# EAGLE board Amplifier+Mixer (EAGLE 9.3.0)
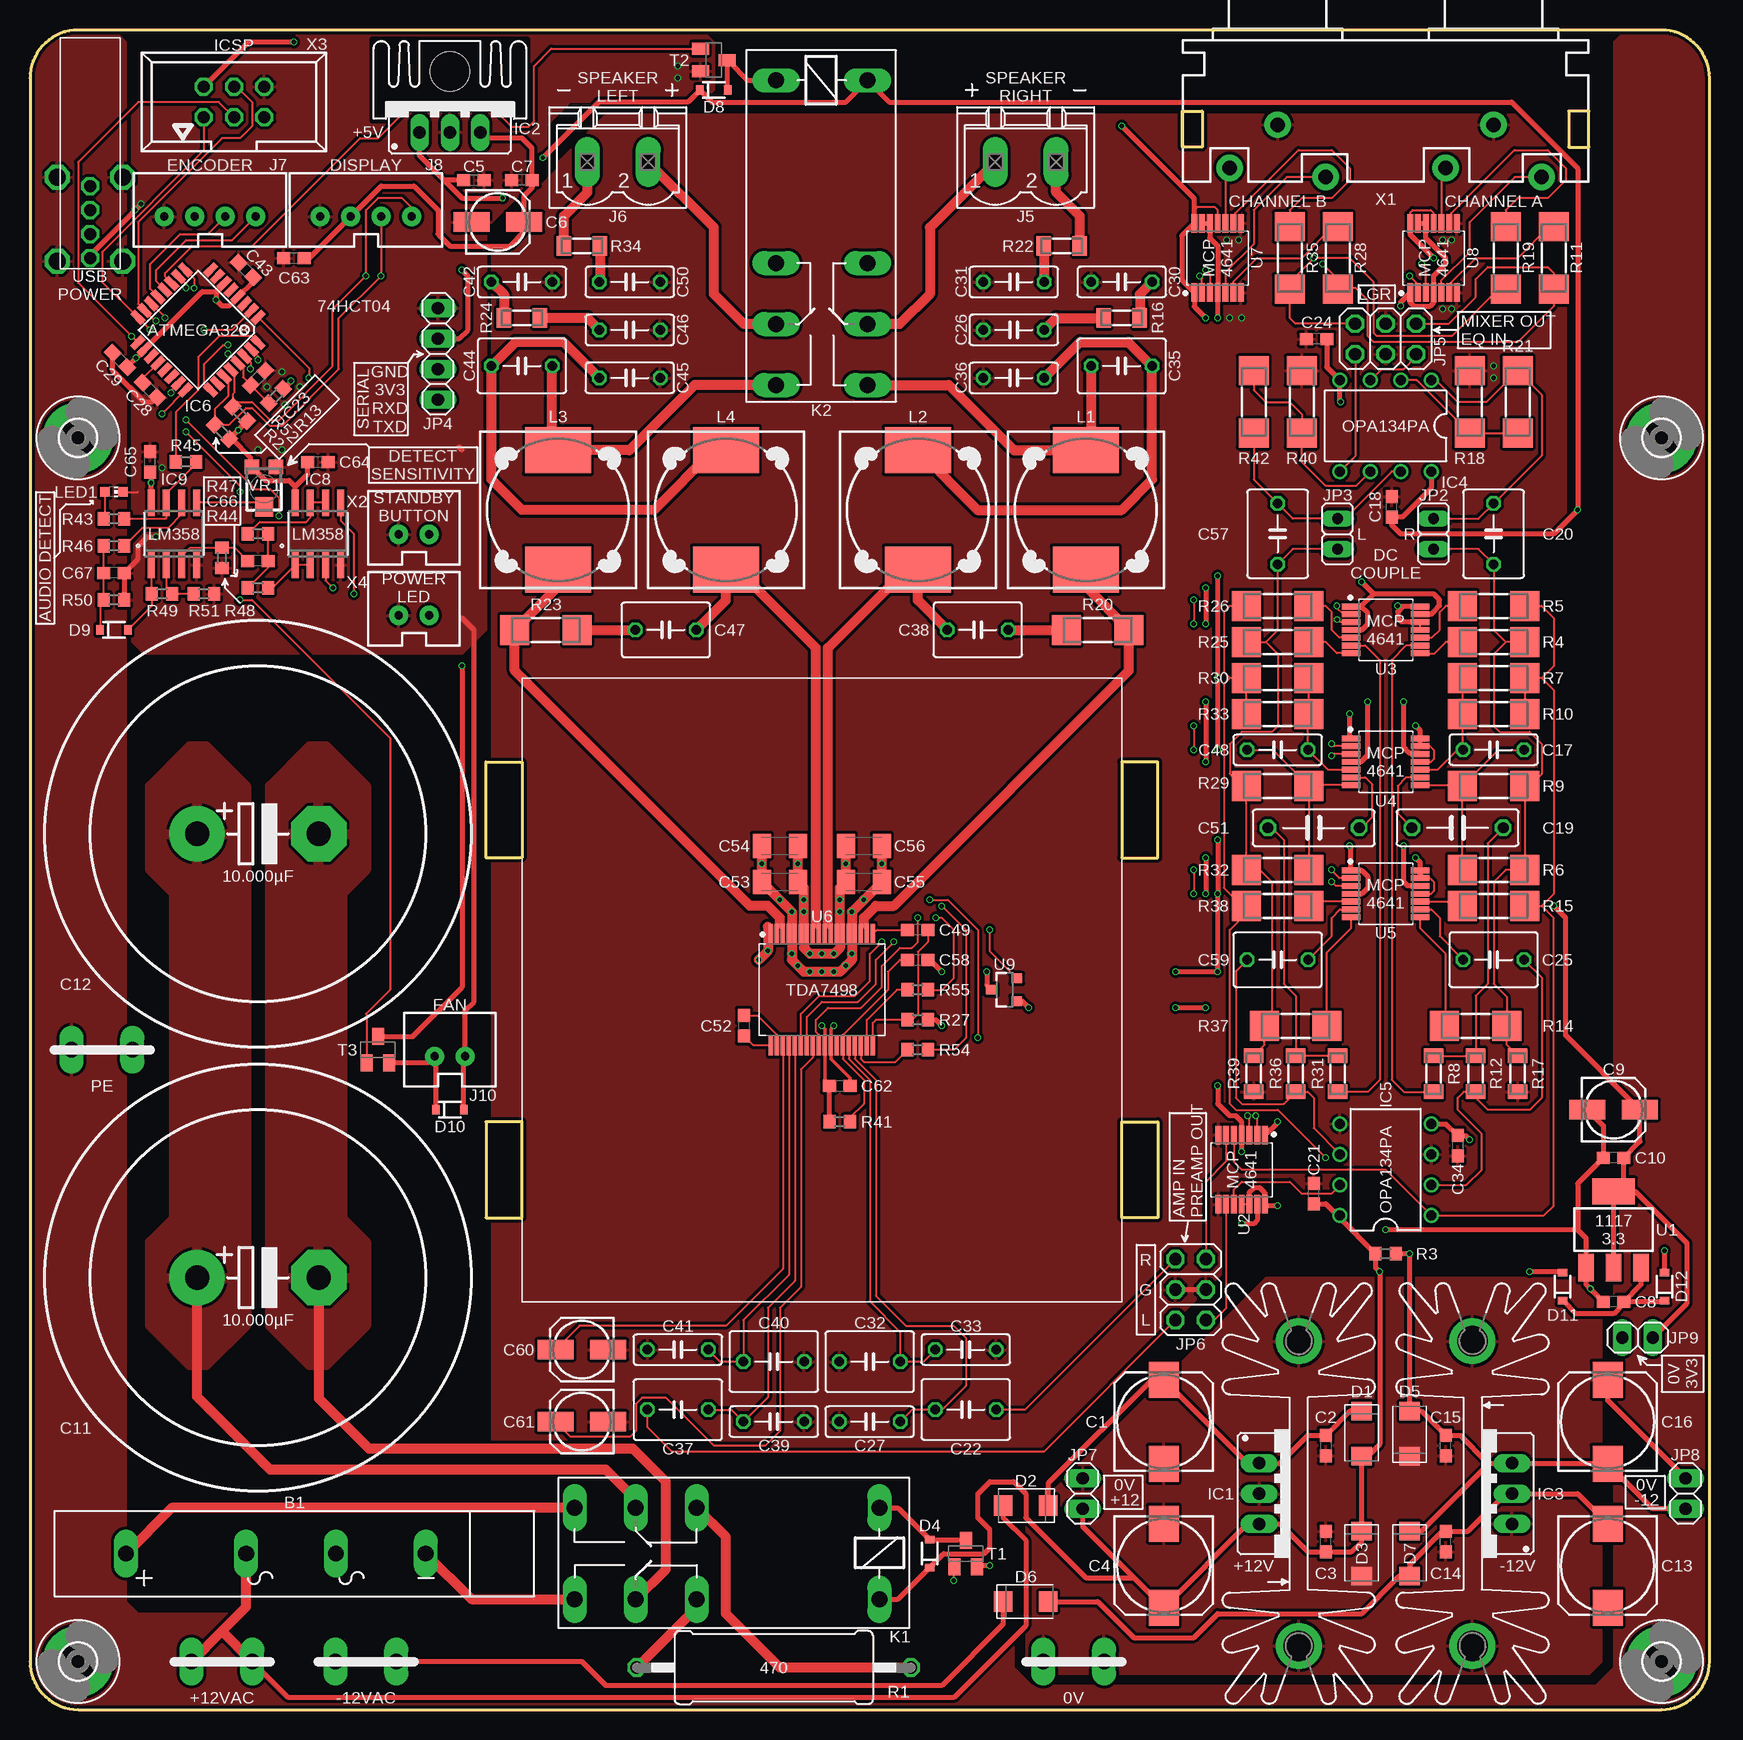
[diagram p2: board, top side]
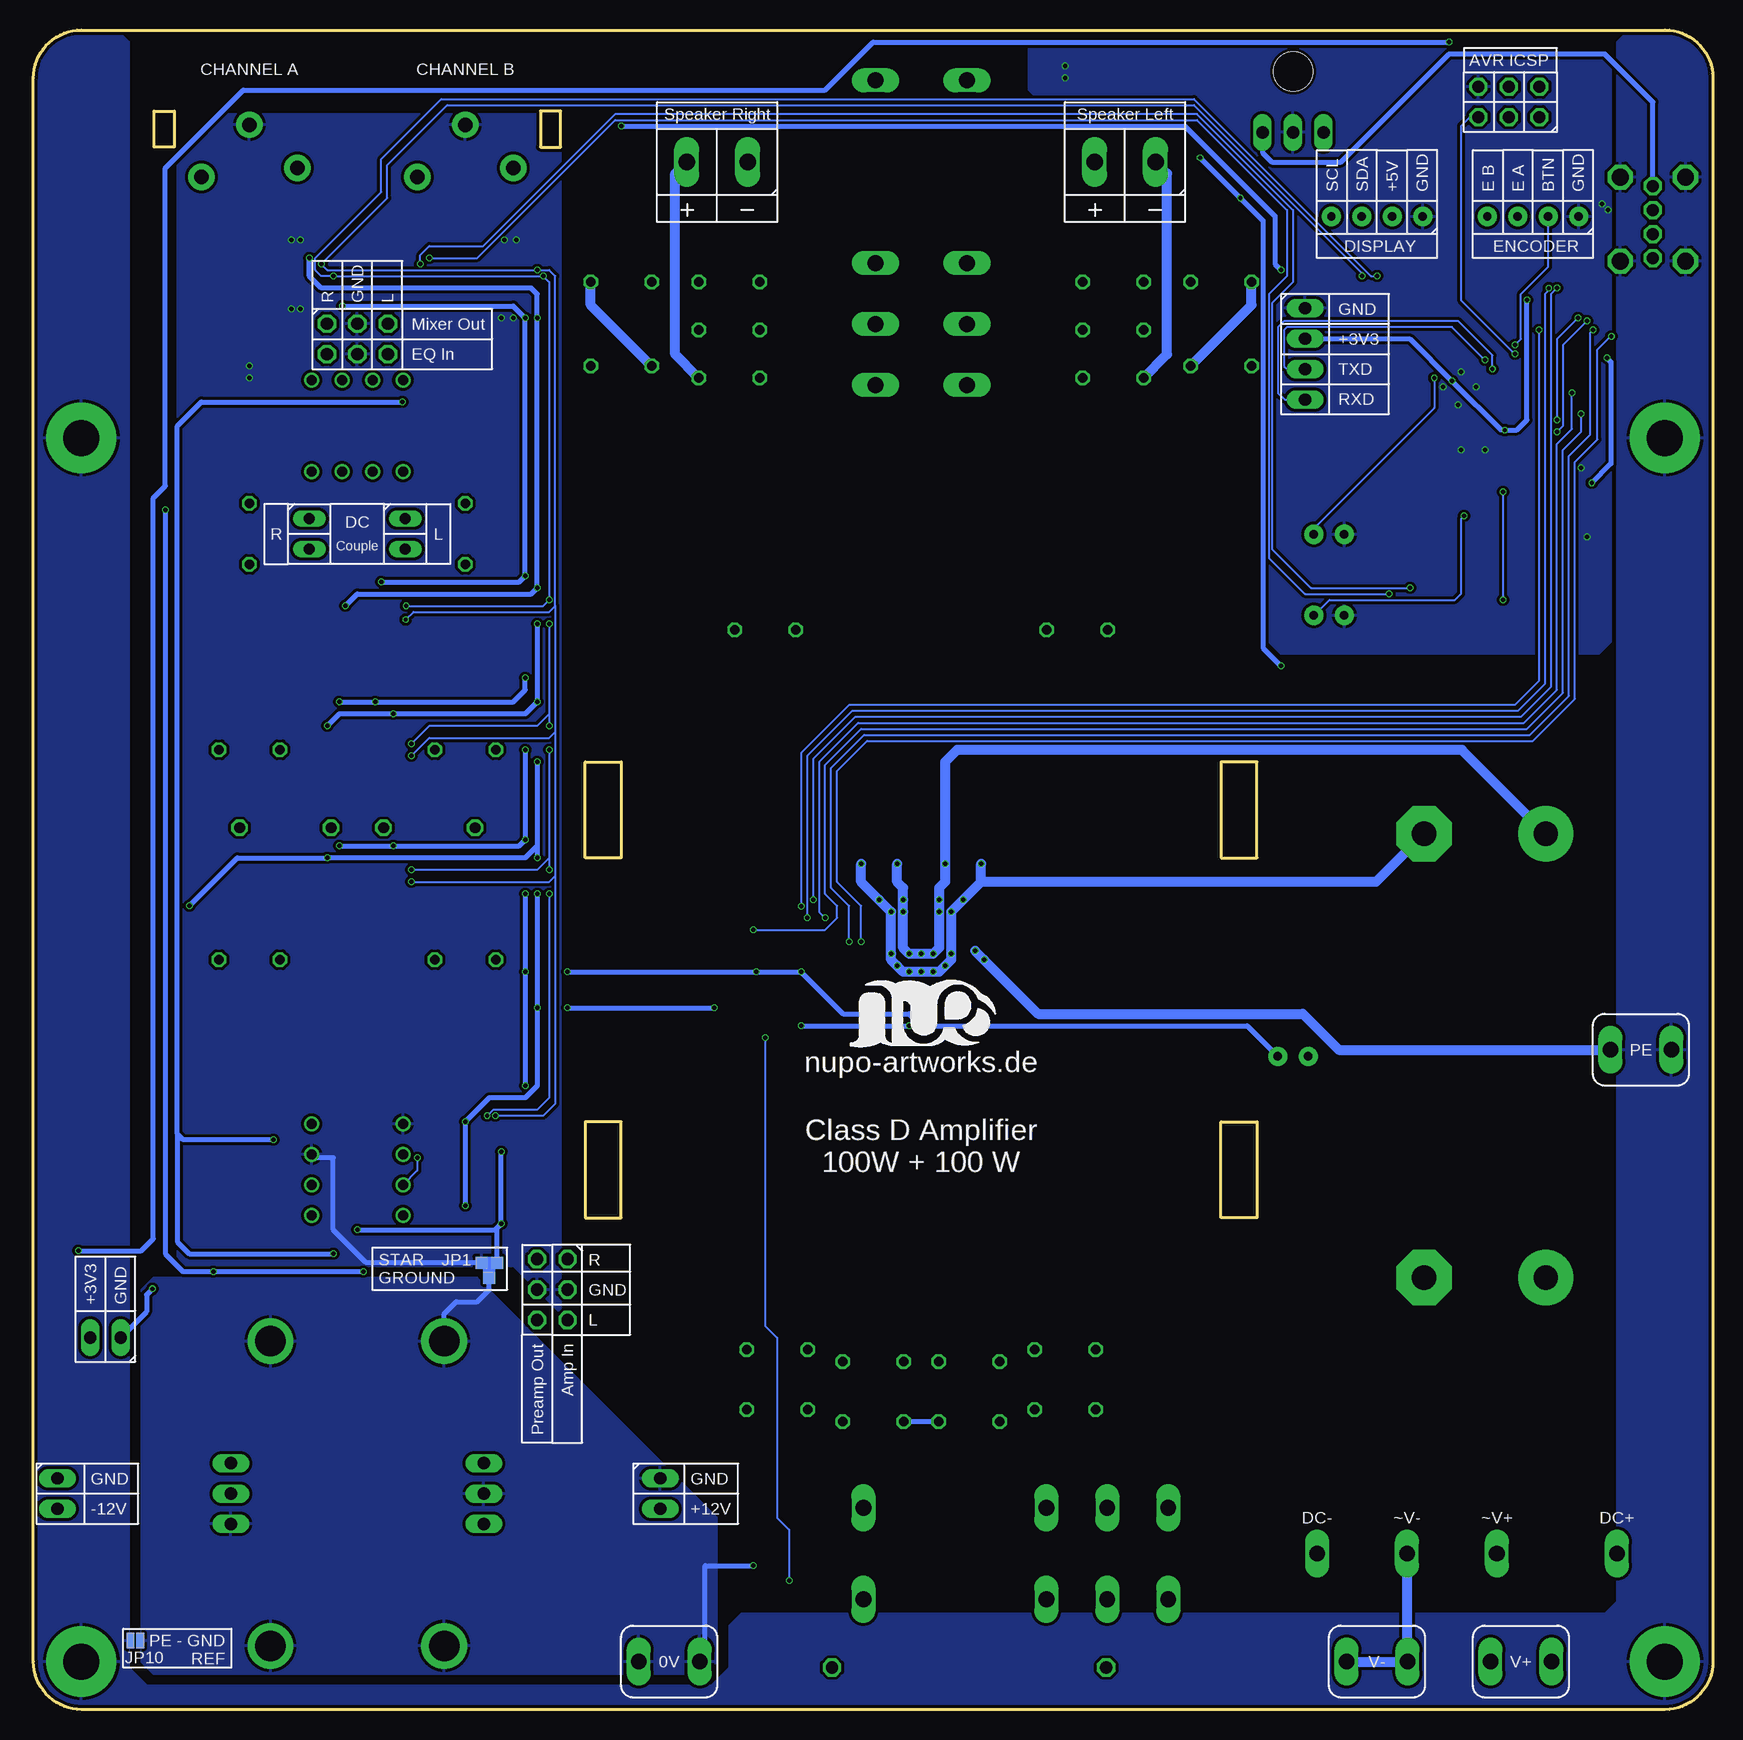
[diagram p3: board, bottom side, seen from below]

Size 140 x 140 mm. Coordinates in mm from the lower left corner, seen from the top.
Outline: 4,0 136,0 arc90 140,4 140,136 arc90 136,140 4,140 arc90 0,136 0,4 arc90 4,0
Outline: 129.95,133.25 128.25,133.25 128.25,130.25 129.95,130.25 129.95,133.25
Outline: 96.05,130.25 96.05,133.25 97.72,133.25 97.72,130.25 96.05,130.25
Outline: 41,49 38,49 38,41 41,41 41,49
Outline: 91,41 91,49 94,49 94,41 91,41
Outline: 91,79 91,71 94,71 94,79 91,79
Outline: 41,79 41,71 38,71 38,79 41,79
Copper layers (1*16): Top 0.035mm / dielectric 1.5mm / Bottom 0.035mm
Design rules "JLCPCB-Tented *": minimum track width 3.5mil, minimum drill 0.2mm, track to track 3.5mil, track to pad 5mil, pad to pad 6mil, via to via 6mil, smd to smd 3.5mil, copper to edge 0.2mm, drill to drill 5mil, minimum pad ring 3mil, minimum via ring 3mil, stop-mask expansion 4mil, vias tented up to drill 0.5mm, thermal gap 10mil

## Footprints (pad centres in the part's own frame; a part is rotated, then mirrored left to right if it is on the bottom)
FB100 = drill 1.321 long: + -14,0; - 10.994,0; AC1 -3.992,0; AC2 3.501,0
175TMP-0810 = smd 3 x 2.5: + 3.5,0; - -3.5,0
C0603 = smd 1.1 x 1: 1 -0.85,0; 2 0.85,0
153CLV-0505 = smd 3 x 1.6: + 2.2,0; - -2.2,0
EB35D = drill 2.007 pad 4.597: + -5.08,0 | drill 2.007 pad 4.597 octagon: - 5.08,0
C050-025X075 = drill 0.813 octagon: 1 -2.54,0; 2 2.54,0
C075-032X103 = drill 0.914 octagon: 1 -3.81,0; 2 3.81,0
C050-050X075 = drill 0.813 octagon: 1 -2.54,0; 2 2.54,0
C050-045X075 = drill 0.813 octagon: 1 -2.54,0; 2 2.54,0
C1206K = smd 1.5 x 2: 1 -1.5,0; 2 1.5,0
SODFL5024X231 = smd 1.52 x 1.68: A 1.88,0; C -1.88,0
SOD-323 = smd 0.63 x 0.83: A 1.15,0; C -1.15,0
3,0-PAD = drill 3 pad 5.842: B3,0 0,0
78XXS = drill 1.016 long: GND 0,-2.54; IN -2.54,-2.54; OUT 2.54,-2.54
79XXS = drill 1.016 long: GND -2.54,-2.54; IN 0,-2.54; OUT 2.54,-2.54
DIL08 = drill 0.813 pad 1.27: 1 -3.81,-3.81; 2 -1.27,-3.81; 3 1.27,-3.81; 4 3.81,-3.81; 5 3.81,3.81; 6 1.27,3.81; 7 -1.27,3.81; 8 -3.81,3.81
TQFP32-08 = smd 1.27 x 0.559: 1 -4.293,2.8; 2 -4.293,2; 3 -4.293,1.2; 4 -4.293,0.4; 5 -4.293,-0.4; 6 -4.293,-1.2; 7 -4.293,-2; 8 -4.293,-2.8; 17 4.293,-2.8; 18 4.293,-2; 19 4.293,-1.2; 20 4.293,-0.4; 21 4.293,0.4; 22 4.293,1.2; 23 4.293,2; 24 4.293,2.8 | smd 0.559 x 1.27: 9 -2.8,-4.293; 10 -2,-4.293; 11 -1.2,-4.293; 12 -0.4,-4.293; 13 0.4,-4.293; 14 1.2,-4.293; 15 2,-4.293; 16 2.8,-4.293; 25 2.8,4.293; 26 2,4.293; 27 1.2,4.293; 28 0.4,4.293; 29 -0.4,4.293; 30 -1.2,4.293; 31 -2,4.293; 32 -2.8,4.293
SO08 = smd 0.6 x 2.2: 1 -1.905,-2.6; 2 -0.635,-2.6; 3 0.635,-2.6; 4 1.905,-2.6; 5 1.905,2.6; 6 0.635,2.6; 7 -0.635,2.6; 8 -1.905,2.6
TE-726386 = drill 1.3 pad 2 long: P$1 -2.54,0; P$2 2.54,0
MSTBV2 = drill 1.397 long: 1 -2.54,0; 2 2.54,0
JST-4-PTH-VERT = drill 0.7 pad 1.6: 1 -3.81,-0.55; 2 -1.27,-0.55; 3 1.27,-0.55; 4 3.81,-0.55
ECON-USBBUVA = drill 1 octagon: D+ 4,0; D- 2,0; V+ 0,0; V- 6,0 | drill 1.4 octagon: S1 -0.73,2.72; S2 6.27,2.72; S3 -0.73,-2.72; S4 6.27,-2.72
JST-2-PTH-VERT = drill 0.7 pad 1.6: 1 -1.27,-0.55; 2 1.27,-0.55
GND_CONNECT = smd 1 x 1: 1 -1.25,0.65; 2 -1.25,-0.65; 3 0,0
JP1 = drill 0.914 long: 1 0,-1.27; 2 0,1.27
1X04 = drill 1.016 long: 1 -3.81,0; 2 -1.27,0; 3 1.27,0; 4 3.81,0
2X03 = drill 1.016 octagon: 1 -2.54,-1.27; 2 -2.54,1.27; 3 0,-1.27; 4 0,1.27; 5 2.54,-1.27; 6 2.54,1.27
1X02 = drill 1.016 long: 1 -1.27,0; 2 1.27,0
SMT-JUMPER_2_NO_NO-SILK = smd 0.635 x 1.27: 1 -0.406,0; 2 0.406,0
F4052 = drill 1.321 long: 1 -3.81,3.81; 2 -3.81,-3.81; O1 11.43,-3.81; O2 11.43,3.81; P1 16.51,-3.81; P2 16.51,3.81; S1 21.59,-3.81; S2 21.59,3.81
SK104-PAD = drill 2.54 pad 3.81: K1 -12.7,-0.762; K2 12.7,-0.762
SK95-2M3 = hole 3.302: 0,2.54
INDUCTOR-12MM = smd 3.85 x 5.5: 1 -4.975,0; 2 4.975,0
CHIP-LED0603 = smd 0.8 x 0.8: A 0,-0.75; C 0,0.75
0617/22 = drill 1.016 octagon: 1 -11.43,0; 2 11.43,0
R0603 = smd 1 x 1.1: 1 -0.85,0; 2 0.85,0
MINI_MELF-0207W = smd 2.4 x 2.5: 1 -2.6,0; 2 2.6,0
MINI_MELF-0204W = smd 1.2 x 1.6: 1 -1.5,0; 2 1.5,0
SOT23-BEC = smd 1 x 1.4: B -0.95,-1.1; C 0,1.1; E 0.95,-1.1
SOT-223 = smd 1.27 x 2.286: 1 -2.286,-3.175; 2 0,-3.175; 3 2.286,-3.175 | smd 3.556 x 2.159: TER 0,3.175
SOP65P640X120-14 = smd 1.533 x 0.488: 1 -2.887,1.95; 2 -2.887,1.3; 3 -2.887,0.65; 4 -2.887,0; 5 -2.887,-0.65; 6 -2.887,-1.3; 7 -2.887,-1.95; 8 2.887,-1.95; 9 2.887,-1.3; 10 2.887,-0.65; 11 2.887,0; 12 2.887,0.65; 13 2.887,1.3; 14 2.887,1.95
SOP50P1010X245-36 = smd 1.703 x 0.34: 1 4.646,4.25; 2 4.646,3.75; 3 4.646,3.25; 4 4.646,2.75; 5 4.646,2.25; 6 4.646,1.75; 7 4.646,1.25; 8 4.646,0.75; 9 4.646,0.25; 10 4.646,-0.25; 11 4.646,-0.75; 12 4.646,-1.25; 13 4.646,-1.75; 14 4.646,-2.25; 15 4.646,-2.75; 16 4.646,-3.25; 17 4.646,-3.75; 18 4.646,-4.25; 19 -4.646,-4.25; 20 -4.646,-3.75; 21 -4.646,-3.25; 22 -4.646,-2.75; 23 -4.646,-2.25; 24 -4.646,-1.75; 25 -4.646,-1.25; 26 -4.646,-0.75; 27 -4.646,-0.25; 28 -4.646,0.25; 29 -4.646,0.75; 30 -4.646,1.25; 31 -4.646,1.75; 32 -4.646,2.25; 33 -4.646,2.75; 34 -4.646,3.25; 35 -4.646,3.75; 36 -4.646,4.25
SOT23-3 = smd 0.8 x 0.9: 1 -0.95,-1; 2 0.95,-1; 3 0,1.1
TRIMPOT-SMD-TC33X = smd 1.2 x 1.2: 1 -1,-1.825; 3 1,-1.825 | smd 1.5 x 1.6: 2 0,1.5
BKL-072385 = drill 1.2 pad 2.184: 1 9,3.1; 2 5,-0.5; 3 13,-1.25; 4 -9,3.1; 5 -13,-0.5; 6 -5,-1.25
057-006-1 = drill 1 octagon: 1 -2.54,-1.27; 2 -2.54,1.27; 3 0,-1.27; 4 0,1.27; 5 2.54,-1.27; 6 2.54,1.27

## Placement (x,y rotation side)
B1  1000V 25A  [FB100]  22,13 0 top
C1  220µ 25V  [175TMP-0810]  94.5,24 90 top
C2  100n  [C0603]  108,22 270 top
C3  100n  [C0603]  108,14 90 top
C4  470µ 16V  [175TMP-0810]  94.5,12 270 top
C5  100n  [C0603]  37,127.5 0 top
C6  4.7µ 10V  [153CLV-0505]  39,124 0 top
C7  100n  [C0603]  41,127.5 180 top
C8  100n  [C0603]  132,34 180 top
C9  4.7µ 10V  [153CLV-0505]  132,50 0 top
C10  100n  [C0603]  132,46 180 top
C11  10mF 50V  [EB35D]  19,36 0 top
C12  10mF 50V  [EB35D]  19,73 0 top
C13  220µ 25V  [175TMP-0810]  131.5,12 270 top
C14  100n  [C0603]  118,14 90 top
C15  100n  [C0603]  118,22 90 top
C16  470µ 16V  [175TMP-0810]  131.5,24 90 top
C17  1n  [C050-025X075]  122,80 180 top
C18  100n  [C0603]  113.5,100.25 90 top
C19  4.7n  [C075-032X103]  119,73.5 180 top
C20  DC COUPLE L  [C050-050X075]  122,98 270 top
C21  100n  [C0603]  107,43 90 top
C22  1µ  [C050-050X075]  78,25 180 top
C23  100n  [C0603]  19,111 225 top
C24  100n  [C0603]  107.25,114.25 180 top
C25  680p  [C050-045X075]  122,62.5 180 top
C26  220n 63V  [C050-025X075]  82,115 180 top
C27  1n  [C050-025X075]  70,24 0 top
C28  100n  [C0603]  10,110 315 top
C29  100n  [C0603]  7.5,112.5 135 top
C30  220n 63V  [C050-025X075]  91,119 180 top
C31  220n 63V  [C050-025X075]  82,119 0 top
C32  1µ  [C050-050X075]  70,29 0 top
C33  1n  [C050-025X075]  78,30 180 top
C34  100n  [C0603]  119,47 270 top
C35  470n 100V  [C050-045X075]  91,112 0 top
C36  220n 63V  [C050-025X075]  82,111 0 top
C37  1µ  [C050-050X075]  54,25 0 top
C38  330p 630V  [C050-045X075]  79,90 180 top
C39  1n  [C050-025X075]  62,24 180 top
C40  1µ  [C050-050X075]  62,29 180 top
C41  1n  [C050-025X075]  54,30 0 top
C42  220n 63V  [C050-025X075]  41,119 0 top
C43  100n  [C0603]  18,120 135 top
C44  470n 100V  [C050-045X075]  41,112 180 top
C45  220n 63V  [C050-025X075]  50,111 180 top
C46  220n 63V  [C050-025X075]  50,115 0 top
C47  330p 630V  [C050-045X075]  53,90 0 top
C48  1n  [C050-025X075]  104,80 0 top
C49  100n  [C0603]  74,65 180 top
C50  220n 63V  [C050-025X075]  50,119 180 top
C51  4.7n  [C075-032X103]  107,73.5 0 top
C52  100n  [C0603]  59.5,57 270 top
C53  1µ 50V  [C1206K]  62.5,69 180 top
C54  1µ 50V  [C1206K]  62.5,72 180 top
C55  0.1µ 100V  [C1206K]  69.5,69 0 top
C56  0.1µ 100V  [C1206K]  69.5,72 0 top
C57  1µ  [C050-050X075]  104,98 270 top
C58  100n  [C0603]  74,62.5 0 top
C59  680p  [C050-045X075]  104,62.5 0 top
C60  10µ 10V  [153CLV-0505]  46,30 180 top
C61  10µ 10V  [153CLV-0505]  46,24 180 top
C62  100n  [C0603]  67.5,52 0 top
C63  100n  [C0603]  22,121 0 top
C64  100n  [C0603]  24,104 0 top
C65  100n  [C0603]  10,104 90 top
C66  100n  [C0603]  19,95.75 180 top
C67  1µ  [C0603]  7,94.75 180 top
D1  4007  [SODFL5024X231]  111,23 270 top
D2  4007  [SODFL5024X231]  83,17 180 top
D3  4007  [SODFL5024X231]  111,13 270 top
D4  1N4148  [SOD-323]  75,13 90 top
D5  4007  [SODFL5024X231]  115,23 90 top
D6  4007  [SODFL5024X231]  83,9 0 top
D7  4007  [SODFL5024X231]  115,13 270 top
D8  1N4148  [SOD-323]  57,135 0 top
D9  1N4148  [SOD-323]  7,90 0 top
D10  1N4148  [SOD-323]  35,50 0 top
D11  1N4148  [SOD-323]  127.75,35.25 90 top
D12  1N4148  [SOD-323]  136.25,35.25 90 top
H1  M3  [3,0-PAD]  136,106 0 top
H2  M3  [3,0-PAD]  136,4 0 top
H3  M3  [3,0-PAD]  4,106 0 top
H4  M3  [3,0-PAD]  4,4 0 top
IC1  LM2940CT-12  [78XXS]  105,18 270 top
IC2  7805  [78XXS]  35,134 0 top
IC3  7912  [79XXS]  121,18 90 top
IC4  LME49720NA  [DIL08]  113,107 180 top
IC5  LME49720NA  [DIL08]  113,45 90 top
IC6  MEGA8-AI  [TQFP32-08]  14,115 225 top
IC8  LM358D  [SO08]  24,98 0 top
IC9  LM358D  [SO08]  12,98 0 top
J1  6MM  [TE-726386]  16,4 0 top
J2  6MM  [TE-726386]  87,4 0 top
J3  6MM  [TE-726386]  28,4 0 top
J4  6MM  [TE-726386]  6,55 0 top
J5  TERMINAL-BLOCK-2PLUG-IN  [MSTBV2]  83,129 0 top
J6  TERMINAL-BLOCK-2PLUG-IN  [MSTBV2]  49,129 0 top
J7  ENCODER  [JST-4-PTH-VERT]  15,125 0 top
J8  DISPLAY  [JST-4-PTH-VERT]  28,125 0 top
J9  USB  [ECON-USBBUVA]  5,127 270 top
J10  JST-XH2  [JST-2-PTH-VERT]  35,55 0 top
JP1  GND_CONNECT  [GND_CONNECT]  102,36 270 bottom
JP2  DC COULE R  [JP1]  117,98 180 top
JP3  DC COUPLE L  [JP1]  109,98 180 top
JP4  SERIAL  [1X04]  34,113 270 top
JP5  MIX OUT  [2X03]  113,114.25 180 top
JP6  PREAMP OUT  [2X03]  96.75,35 270 top
JP7  [1X02]  87.75,18 270 top
JP8  [1X02]  138,18 270 top
JP9  [1X02]  134,31 0 top
JP10  PEGND  [SMT-JUMPER_2_NO_NO-SILK]  131.5,5.75 180 bottom
K1  12V 8A  [F4052]  67,13 180 top
K2  12V 8A  [F4052]  66,132 270 top
KK1  HEATSINK-SK104  [SK104-PAD]  105,18 90 top
KK2  HEATSINK-SK95  [SK95-2M3]  35,134 0 top
KK3  HEATSINK-PENTIUM  [HEATSINK-PENTIUM]  66,60 0 top
KK4  HEATSINK-SK104  [SK104-PAD]  121,18 270 top
L1  22µ 2.2A  [INDUCTOR-12MM]  88,100 90 top
L2  22µ 2.2A  [INDUCTOR-12MM]  74,100 90 top
L3  22µ 2.2A  [INDUCTOR-12MM]  44,100 90 top
L4  22µ 2.2A  [INDUCTOR-12MM]  58,100 90 top
LED1  [CHIP-LED0603]  7,101.5 270 top
R1  470  [0617/22]  62,3.5 180 top
R2  4k7  [R0603]  16,106.5 315 top
R3  10k  [R0603]  113,38 0 top
R4  7.68k  [MINI_MELF-0207W]  122,89 0 top
R5  7.68k  [MINI_MELF-0207W]  122,92 180 top
R6  5.6k  [MINI_MELF-0207W]  122,70 0 top
R7  5.6k  [MINI_MELF-0207W]  122,86 180 top
R8  100k  [MINI_MELF-0204W]  117,53 270 top
R9  5.6k  [MINI_MELF-0207W]  122,77 0 top
R10  5.6k  [MINI_MELF-0207W]  122,83 180 top
R11  7.68k  [MINI_MELF-0207W]  127,121 270 top
R12  100k  [MINI_MELF-0204W]  120.5,53 90 top
R13  10k  [R0603]  20.5,109.5 45 top
R14  7.68k  [MINI_MELF-0207W]  120.5,57 0 top
R15  7.68k  [MINI_MELF-0207W]  122,67 180 top
R16  8R 0.4W  [MINI_MELF-0204W]  91,116 0 top
R17  100k  [MINI_MELF-0204W]  124,53 90 top
R18  7.68k  [MINI_MELF-0207W]  120,109 90 top
R19  7.68k  [MINI_MELF-0207W]  123,121 270 top
R20  22R 1W  [MINI_MELF-0207W]  89,90 0 top
R21  7.68k  [MINI_MELF-0207W]  124,109 270 top
R22  8R 0.4W  [MINI_MELF-0204W]  86,122 180 top
R23  22R 1W  [MINI_MELF-0207W]  43,90 180 top
R24  8R 0.4W  [MINI_MELF-0204W]  41,116 180 top
R25  7.68k  [MINI_MELF-0207W]  104,89 180 top
R26  7.68k  [MINI_MELF-0207W]  104,92 0 top
R27  22  [R0603]  74,57.5 0 top
R28  7.68k  [MINI_MELF-0207W]  109,121 270 top
R29  5.6k  [MINI_MELF-0207W]  104,77 180 top
R30  5.6k  [MINI_MELF-0207W]  104,86 0 top
R31  100k  [MINI_MELF-0204W]  109,53 270 top
R32  5.6k  [MINI_MELF-0207W]  104,70 180 top
R33  5.6k  [MINI_MELF-0207W]  104,83 0 top
R34  8R 0.4W  [MINI_MELF-0204W]  46,122 0 top
R35  7.68k  [MINI_MELF-0207W]  105,121 270 top
R36  100k  [MINI_MELF-0204W]  105.5,53 90 top
R37  7.68k  [MINI_MELF-0207W]  105.5,57 180 top
R38  7.68k  [MINI_MELF-0207W]  104,67 0 top
R39  100k  [MINI_MELF-0204W]  102,53 90 top
R40  7.68k  [MINI_MELF-0207W]  106,109 90 top
R41  39k  [R0603]  67.5,49 0 top
R42  7.68k  [MINI_MELF-0207W]  102,109 90 top
R43  1k  [R0603]  7,99.25 180 top
R44  10k  [R0603]  19,93.5 0 top
R45  1k  [R0603]  13,104 0 top
R46  100k  [R0603]  7,97 180 top
R47  10k  [R0603]  19,98 0 top
R48  100k  [R0603]  16,96 90 top
R49  100k  [R0603]  11,93 0 top
R50  1k  [R0603]  7,92.5 180 top
R51  1k  [R0603]  14.5,93 180 top
R52  4k7  [R0603]  17.5,108 315 top
R54  39k  [R0603]  74,55 0 top
R55  39k  [R0603]  74,60 0 top
T1  BC817  [SOT23-BEC]  78,13 0 top
T2  BC817  [SOT23-BEC]  57,137.5 270 top
T3  BC817  [SOT23-BEC]  29,55 0 top
U1  LM1117-3.3  [SOT-223]  132,40 0 top
U2  10k  [SOP65P640X120-14]  101,45 270 top
U3  10k  [SOP65P640X120-14]  113,90 0 top
U4  10k  [SOP65P640X120-14]  113,79 0 top
U5  10k  [SOP65P640X120-14]  113,68 0 top
U6  TDA7498L  [SOP50P1010X245-36]  66,60 90 top
U7  10k  [SOP65P640X120-14]  99,121 90 top
U8  10k  [SOP65P640X120-14]  117,121 90 top
U9  MCP9701SMD  [SOT23-3]  81.25,60 90 top
U$1  [LOGO-SILKSCREEN]  66,57 0 bottom
VR1  100k  [TRIMPOT-SMD-TC33X]  19.5,101.75 180 top
X1  RCA-4-CHANNEL  [BKL-072385]  113,129 0 top
X2  JST-XH2  [JST-2-PTH-VERT]  32,98.5 0 top
X3  ICSP  [057-006-1]  17,134 0 top
X4  JST-XH2  [JST-2-PTH-VERT]  32,91.75 0 top

## Tracks (layer width: path | path; a pad name or v marks a point on that pad's centre or on a via)
+3V3  (via drill 0.35)
  Top 0.152: U7.11 99,125 98.75,125.25 97.3,125.25 97.05,125 | U8.11 117,124.75 116.75,125 115.25,125 115.05,124.8 U8.14 | U2.12 U2.11 | U3.11 U3.12 | U4.11 116.75,79 117,79.25 117,80 116.7,80.3 U4.13 | U5.11 116.75,68 117,68.25 117,69 116.7,69.3 U5.13
  Top 0.406: IC9.8 v10.1,102.25 10.1,103.06 C65.1 | R52.2 v17.35,106.65 R2.2 16.85,105.9 18.38,104.38 18.38,103.7 VR1.3 19.63,102.44 21.59,102.44 22.09,101.94 | C64.1 23.15,103 22.09,101.94 | C43.1 18.6,119.03 IC6.4 16.57,117 16,117 v15.5,117.5 15.5,118.2 | U3.12 114.35,90.65 114,91 114,91.5 114.45,91.95 | U3.14 114.45,91.95 | 114.45,91.95 114.05,91.95 v114,92 | v98,116 97.05,116.95 U7.1 96,119.16 96,122.84 U7.14 97.05,125 97.05,125.95 v91,132 | v117,121 115.05,122.95 U8.14 | v98,93.5 v98,90.5 | U4.13 U4.14 115.89,81.61 v115.5,82 | U4.1 110,81.06 v110,83 | v98,84 v98,79 | v115.5,71 115.89,70.61 U5.13 U5.14 | v98,71 v98,68 | U2.1 104,48.94 v104,49 | v104,42 103.06,42 U2.14 102.95,43.05 102.5,43.5 102,43.5 101.65,43.15 U2.12 | v98,58.5 v95.5,58.5 | IC6.6 15.5,118.2 | 15.5,118.2 14.37,118.2 IC6.18 v8.84,112.66 8.1,111.93 C29.1 | R13.2 v21.75,110.75 | U1.2 U1.TER | U1.TER 132.85,44.02 C10.1 134.2,47.35 C9.+ 128,56.2 128,66 v127,67 | v36,120 36.5,119.5 36.5,115 35.77,114.27 JP4.2 | IC8.8 22.09,101.94 | JP9.2 138.13,33.87 138.13,38.87 133.82,43.17 U1.TER | v83.25,58.5 82.7,59.05 U9.1
  Bottom 0.406: v114,92 113,93 98.5,93 v98,93.5 v98,116 98,118 98.5,118.5 116,118.5 117,119.5 v117,121 | v98,90.5 v98,84 99,83 v110,83 114.5,83 v115.5,82 | v98,79 98,72 | 98,72 99,71 v115.5,71 123,71 v127,67 | 98,72 v98,71 | v98,68 v98,58.5 98,52 99,51 102,51 v104,49 v104,42 | v95.5,58.5 v83.25,58.5 | JP4.2 25.27,114.27 v21.75,110.75 17.65,106.65 v17.35,106.65 16.35,106.65 15.5,107.5 v15.5,117.5 | v91,132 44,132 36.5,124.5 36.5,120.5 v36,120 | v8.84,112.66 8.5,112.33 8.5,103.84 v10.1,102.25
+5V
  Top 0.406: IC2.OUT 38,131 41,131 41.85,130.15 C7.1 41.85,126.85 41.2,126.2 C6.+ 41.2,123.2 40,122 35,122 34,123 34,125 32,127 29.28,127 J8.2 23.28,121 C63.2
  Bottom 0.406: J9.V+ 5,134 9,138 22,138 31,129 36.75,129 37.54,129.79 IC2.OUT
+12V  (via drill 0.35)
  Top 0.406: IC2.IN 32.46,129.54 34.5,127.5 | 34.5,127.5 36,126 v39.39,126 | 109.19,40.96 R3.1 112.15,36.85 v112.5,36.5 112.5,22.12 111.38,21 111,21 D1.A D3.C 111,14 110.15,13.15 C3.1 106.5,13.15 104.19,15.46 IC1.OUT 101.46,15.46 C4.+ 92,11 | 109.19,40.96 IC5.8 | C21.1 108,42.15 109.19,40.96 | K1.1 72.34,9.19 D4.C 76.15,13 79.5,13 80,13.5 80,15 79,16 79,18 80,19 82,19 83,18 83,16 88,11 92,11 | C5.1 34.5,127.5 | v36,87 36,60.2 31.9,56.1 T3.C | IC4.8 116.81,101.81 114.4,99.4 C18.1 113.5,98.75 114.25,98 127,98 v129,100 129,128.5 123.5,134 71.62,134 K2.1 68,134 56.85,134 D8.C 54.85,134 47.39,134 v42.75,129.36 | 92,11 87.75,15.25 JP7.2 | D11.A 127.65,36.5 v125,36.5
  Bottom 0.406: v112.5,36.5 v125,36.5 127.5,36.5 129,38 v129,100 | v42.75,129.36 v39.39,126 37.5,124.11 37.5,88.5 v36,87
+18V  (via drill 0.35)
  Top 0.152: U6.6 64.25,65.25 64.5,65.5 64.75,65.25 U6.7 | U6.12 67.25,65.25 67.5,65.5 67.75,65.25 U6.13
  Top 0.813: C54.1 v64,70.5 C53.1 64.5,68.5 v64.5,67.5 v64.5,66.5 64.5,65.5 64.5,63.5 v65,63 v66,63 v67,63 67.5,63.5 67.5,65.5 v67.5,66.5 v67.5,67.5 67.5,68.5 C55.1 v68,70.5 C56.1 | K1.P1 50.49,17.51 48,20 20,20 13.92,26.08 C11.+
  Bottom 0.813: C12.+ 20.92,80 63,80 64,79 v64,70.5 C53.1 64.5,68.5 v64.5,67.5 v64.5,66.5 64.5,63.5 v65,63 v66,63 v67,63 67.5,63.5 v67.5,66.5 v67.5,67.5 67.5,68.5 C55.1 v68,70.5
  pour Top: 18,32 14.71,28.71 13.29,28.71 10,32 10,39 12,41 12,68 10,70 10,77 13.29,80.29 14.71,80.29 18,77
-12V  (via drill 0.35)
  Top 0.406: IC5.4 118.04,48.81 C34.1 119.65,47.85 v120,47.5 | R3.2 v115,38 D5.A 115.97,24.88 C15.2 119.23,22.85 121.54,20.54 121.66,20.54 | 121.66,20.54 IC3.OUT 123.58,20.5 C16.- 135.27,16.73 JP8.2 | v109.25,109 109.19,109.06 IC4.4 108.1,111.9 C24.1 | 121.66,20.54 116,14.88 D7.C
  Bottom 0.406: v109.25,109 126,109 128,107 128,48 | v120,47.5 127.5,47.5 128,48 | 128,48 128,39 127,38 v115,38
-18V  (via drill 0.35)
  Top 0.152: U6.4 63.25,65.25 63.5,65.5 63.75,65.25 U6.5 | U6.14 68.25,65.25 68.5,65.5 68.75,65.25 U6.15
  Top 0.813: C54.2 v61,70.5 C53.2 v62.5,67.5 v63.5,66.5 63.5,65.5 v63.5,63 63.5,62.5 v64,62 64.5,61.5 v65,61.5 v66,61.5 v67,61.5 67.5,61.5 v68,62 68.5,62.5 v68.5,63 68.5,65.5 v68.5,66.5 v69.5,67.5 C55.2 v71,70.5 C56.2 | K1.P2 53,11.7 53,19 50.25,21.75 28.25,21.75 24.08,25.92 C11.-
  Bottom 0.813: C12.- 28.08,69 C53.2 | C53.2 v62.5,67.5 v63.5,66.5 v63.5,63 63.5,62.5 v64,62 64.5,61.5 v65,61.5 v66,61.5 v67,61.5 67.5,61.5 v68,62 68.5,62.5 v68.5,63 v68.5,66.5 v69.5,67.5 C55.2 v71,70.5 | C53.2 v61,70.5
  pour Top: 20,32 20,77 23.29,80.29 24.71,80.29 28,77 28,70 26,68 26,41 28,39 28,32 24.71,28.71 23.29,28.71
AGND  (via drill 0.35)
  Top 0.406: JP6.4 JP6.3
  Bottom 0.406: JP1.2 112.25,37.25 115,40 115,46 116.54,46 IC5.3 | C39.1 C27.1
  other vias: 122,111 122,112 118.5,116.75 117.75,116.75 117.75,122.5 118.5,122.5 100.75,122.5 99.75,122.5 101,116 100,116
  pour Top (isolate 0.254): 48,133 127,133 128,132 128,37 100,37 83,20 39.5,20 38.5,21 38.5,123 44,128.5 44,129
  pour Bottom (isolate 0.254): 96,33 96,133 127,133 128,132 128,37 100,37
AMP_DIAG  (via drill 0.35)
  Top 0.152: U6.28 65.75,56.25 65.5,56.5 65.5,57.5 66.5,58.5 69.25,58.5 71,60.25 71,62 72.5,63.5 73.5,63.5 74,64 v74,66 | IC6.23 11.75,109.92 v11.75,109.75
  Bottom 0.152: v74,66 74.5,66.5 74.5,79 71.25,82.25 15.75,82.25 13,85 13,105.5 11.75,106.75 v11.75,109.75
AMP_MUTE  (via drill 0.35)
  Top 0.152: IC6.2 16.83,115 v14.5,115 | v76,66.97 78,64.97 78,56 77,55 R54.2
  Bottom 0.152: v14.5,115 14.5,85.75 16.5,83.75 72,83.75 76,79.75 v76,66.97
AMP_MUTE_CL
  Top 0.152: U6.21 69.25,54.25 69.5,54 72.15,54 R54.1
AMP_PWR  (via drill 0.35)
  Top 0.152: IC6.10 13,118.83 v13,118.5 | v75,67.5 76.5,67.5 79,65 v79,56 | v77,10.75 77,11.85 T1.B
  Bottom 0.152: v13,118.5 13.5,118 13.5,85.25 16,82.75 71.5,82.75 75,79.25 v75,67.5 | v79,56 79,32 78,31 78,16 77,15 v77,10.75
AMP_STBY  (via drill 0.35)
  Top 0.152: R55.2 76,60 77,61 77,65 76,66 v75.5,66 | IC6.9 13.68,119.28 v13.68,118.48
  Bottom 0.152: v13.68,118.48 13.68,118.32 14,118 14,85.5 16.25,83.25 71.75,83.25 75.5,79.5 v75.5,66
AMP_STBY_CL
  Top 0.152: U6.20 69.75,57.5 72.25,60 R55.1
AUDIO_DETECT
  Top 0.152: IC6.32 18.46,114.5 15.75,114.5 14,112.75 14,110 12.15,108.15 R45.1
DGND  (via drill 0.35)
  Top 0.152: LED1.C 9,101.5
  Top 0.305: v66,57 66.25,56.75 U6.27 66.25,52.4 C62.1
  Top 0.406: U3.13 116.8,91.3 117.13,91.63 117.13,91.65 117.49,92.01 117.49,92.51 117,93 112,93 | 110.95,91.95 U3.1 | 112,93 110.95,91.95 | U3.4 111,90 111.5,90.5 111.5,91.4 110.95,91.95 | 112,93 v111,94 | v99,116 U7.4 99,122 98.35,122.65 U7.12 U7.13 | U8.13 U8.12 116.35,122.65 118,121 118,120.52 117,119.52 U8.4 117,117.29 116.71,117 115.34,117 115.05,117.29 U8.1 114.25,117.31 v114.25,117 | U4.12 115.81,79.73 114.98,79.73 114.5,80.21 v114.5,84 | v99,94.5 v99,86 v99,80 | U4.4 110.94,79 111.5,79.56 v111.5,84 | U5.12 114.85,68.65 114.5,69 v114.5,72 | v110,72 110.11,71.89 U5.1 111,69.95 111.5,69.45 111.5,68.5 111,68 U5.4 | v99,72.5 v99,68 v99,61.5 v95.5,61.5 | v99,52 99,50.5 100,49.5 100.5,49.5 101,49 U2.4 v101,46.5 | U2.13 102.3,40.8 102,40.5 v101,40.5 | C58.2 75,62.5 v76,61.5 | R41.1 C62.1 | 129,40 129.71,39.29 U1.1 129.71,35.44 v130.07,35.08 C8.2 | 129,40 v113,40 | 129,40 129,43.85 C10.2 131.15,48.65 C9.- | D10.A 36.15,54.33 J10.2 36.27,58.27 37,59 37,90 36,91 | 36,105 35.73,105.27 | C28.2 10.2,109 9.5,109 6.9,111.6 C29.2 | R50.1 C67.1 9,95.9 9,97 9.75,97.75 v10.5,97.75 | J9.V- 5,121.25 v8.75,125 v9.25,125.5 | v79.75,61.5 79.75,60.4 U9.3
  Bottom 0.406: v111,94 99.5,94 v99,94.5 v99,116 100,117 v114.25,117 | v114.5,84 v111.5,84 100,84 99,85 v99,86 | v114.5,72 v110,72 99.5,72 v99,72.5 v99,80 | v99,68 v99,52 | v101,40.5 v101,46.5 | v95.5,61.5 v79.75,61.5 v76,61.5 72.5,58 67,58 v66,57 38.82,57 J10.2 | v101,40.5 101.5,40 v113,40 | JP1.1 101.35,40.15 v101,40.5 | JP9.1 130.57,33.16 130.57,34.58 v130.07,35.08
  other vias: 54,137 54,136 21,111.5 19.75,110.25 19,105 21,105 21.25,108.75 22.5,110.25 11,103.5
  pour Top (isolate 0.254): 9.5,140 56,140 57,139 57,135 56,134 45,134 43,132 43,128.5 38,123.5 38,90 36,88 9.5,88 8.5,89 8.5,139
  pour Bottom (isolate 0.254): 45,134 56,134 57,135 57,139 56,140 9.5,140 8.5,139 8.5,89 9.5,88 36,88 37.5,89.5 37.5,123 43,128.5 43,132
ENC_BTN  (via drill 0.35)
  Top 0.152: IC6.25 14.5,110.54 14.5,112.16 16.09,113.75 v16.5,113.75
  Bottom 0.152: v16.5,113.75 16,114.25 16,118 13.73,120.27 J7.2
EQ_L
  Top 0.152: JP5.6 110.46,104.46 IC4.5
EQ_OUT_L  (via drill 0.35)
  Top 0.152: R26.1 100,92 99.5,91.5 99.5,86.5 100,86 | R33.1 R30.1 100,86 | 100,86 99.5,85.5 99.5,68.5 101,67 R38.1 101.4,66.4 100,65 100,50.5 100.5,50 104,50 v108,46 | IC5.7 108.46,43 106,43 105,44 101,44 100.35,43.35 U2.10
  Bottom 0.152: v108,46 108,44.92 IC5.7
EQ_OUT_R
  Top 0.152: R5.1 126,92 127,91 127,87 126,86 | 126,86 R7.1 R10.1 | 126,86 127,85 127,68 126,67 | R15.1 126,67 | 126,67 127,66 127,42 126.19,41.19 IC5.1 113,45 101,45 100.35,45.65 U2.5
EQ_R
  Top 0.152: IC4.3 112.67,111.75 114.5,111.75 115.54,112.79 JP5.2
FAN_CTL  (via drill 0.35)
  Top 0.152: X3.4 17.23,135.27 18.5,134 18.5,132 17.5,131 16,131 9,124 9,117.17 IC6.15 10.42,115.75 v10.5,115.75 | v13,106.5 17.5,102 v17.5,101.5 | v17.5,92.5 18.5,92.5 30,81 30,60 28,58 28.05,57.95 T3.B
  Bottom 0.152: v17.5,101.5 v17.5,92.5 | v13,106.5 12.5,107 12.5,113.75 v10.5,115.75
GAIN0  (via drill 0.35)
  Top 0.152: X3.1 14.46,129.96 6,121.5 6,119 6.04,119 IC6.16 10,115.04 v10,115 | U6.30 64.75,57.75 66,59 69,59 70.5,60.5 70.5,62.5 v72,64
  Bottom 0.152: v72,64 72,67 73.5,68.5 73.5,78.5 70.75,81.25 15.25,81.25 12,84.5 12,104.5 10.25,106.25 10.25,114.75 v10,115
GAIN1  (via drill 0.35)
  Top 0.152: X3.3 15.73,134 9,134 4,129 4,118.93 v8.46,114.47 IC6.17 | U6.31 64.25,58 65.75,59.5 68.75,59.5 70,60.75 70,63 v71,64
  Bottom 0.152: v71,64 71,67 73,69 73,78.25 70.5,80.75 15,80.75 11.5,84.25 11.5,104 9.62,105.88 9.62,113.38 8.54,114.47 v8.46,114.47
GND  (via drill 0.35)
  Top 0.406: v80,12 79.05,12 T1.E | JP8.1 131.5,25.77 C16.+
  Bottom 0.406: JP1.3 102,35 103,34 104.75,34 105.76,32.99 KK1.K2 | J2.P$1 84,4.46 84,12 v80,12
  pour Top (isolate 0.254): 83,16 83,4 84,3 130,3 131,4 131,35 130,36 103,36
  pour Bottom (isolate 0.254): 103,36 130,36 131,35 131,4 130,3 84,3 83,4 83,16
INNA
  Top 0.152: C33.2 74.46,29 C32.2 72.54,31.5 70,34.04 70,52.5 68.25,54.25 U6.23
INNB
  Top 0.152: C40.2 57.54,29 C41.2 | U6.33 63.25,36.25 59.46,32.46 C40.2 | C40.2
INPA
  Top 0.152: C27.2 73.54,25 C22.2 76,25 78,27 78,31 77,32 73,32 70.5,34.5 70.5,52.5 68.75,54.25 U6.22
INPB
  Top 0.152: U6.32 63.75,35.75 61.5,33.5 61.5,26.04 C39.2 58.46,25 C37.2
L_OUT+
  Top 0.813: C44.1 43.54,105.44 L3.2 49.98,104.97 55.41,110.41 K2.S1 | C42.1 39.5,117.96 R24.2
  Bottom 0.813: C44.1 38.46,117.08 C42.1
L_OUT-
  Top 0.813: C45.2 44.46,114 40.46,114 C44.2 38.46,102.54 41,100 52,100 56.98,104.97 L4.2 | R34.1 44.5,124.5 46.46,126.46 J6.1
  Bottom 0.813: C45.2 45.5,112.96 45.5,128.04 J6.1
MIX_AMP_L
  Top 0.152: IC4.7 113.52,103.19 109.6,99.27 JP3.1 105.27,99.27 C57.1 102,102.54 R42.1
MIX_AMP_R
  Top 0.152: IC4.1 117.19,110.81 119,109 121.4,109 R21.1 126,109.6 126,104.54 C20.1 120.73,99.27 JP2.1
MIX_L  (via drill 0.35)
  Top 0.152: R19.2 122.4,118.4 118.5,114.5 112.25,114.5 112,114.75 112,119 110,121 v107,121 105,119 R35.2 105,116 105.48,115.52 JP5.5 | IC8.5 25.91,99.09 27,98 v27,93
  Bottom 0.152: v107,121 103,121 91.5,132.5 43,132.5 35.5,125 35.5,119.5 37,118 37,96 34,93 v27,93
MIX_R  (via drill 0.35)
  Top 0.152: IC8.3 24.64,94.11 v25.25,93.5 | R28.2 109,118.5 | 109,118.5 109,119.25 v107.75,120.5 | 109,118.5 110.5,118.5 111.5,117.5 111.5,114.5 112,114 124,114 127,117 R11.2 127,119.75 126.5,120.25 121.5,120.25 120.5,119.25 120.5,117.75 118.27,115.52 JP5.1
  Bottom 0.152: v107.75,120.5 107.75,121.25 107,122 102.5,122 91.5,133 43,133 35,125 35,119 36.75,117.25 36.75,96.75 33.5,93.5 v25.25,93.5
N$1
  Top 0.152: JP2.2 120.73,96.73 C20.2 122,90 123,89 | R4.2 123,89 | 123,89 122,88 122,82 122.5,81.5 125,81.5 126,80.5 126,78 125,77 R9.2 R6.2 123,70 122,69 122,60.5 123.1,59.4 R14.2 123.1,55.4 R17.2
N$2
  Top 0.152: R14.1 118,57.1 118,63 115.89,65.11 U5.8
N$3
  Top 0.152: U5.9 116.8,66.7 117.5,66 117.5,64.46 C25.2
N$4
  Top 0.152: U5.10 119.05,67.35 R15.2
N$5
  Top 0.152: R9.1 122.4,80 C17.1 | U4.8 119.35,77.05 R9.1 | R6.1 R9.1
N$6
  Top 0.152: R39.2 102.9,55.4 R37.2 103.5,57.6 103.5,69 102.5,70 R32.2 R29.2 101,77 100,78 100,80.5 101,81.5 103.5,81.5 104,82 104,88 103,89 | R25.2 103,89 | JP3.2 105.27,96.73 C57.2 104,90 103,89
N$7
  Top 0.152: U3.9 114.7,88.7 113.5,87.5 113.5,52.5 114.5,51.5 R8.2
N$8
  Top 0.152: R31.2 111.5,51.5 112.5,52.5 112.5,87.5 111.3,88.7 U3.6
N$9
  Top 0.813: K1.S1 11.81,16.81 B1.+
N$10
  Top 0.152: U3.5 109.15,89.35 108.5,90 108.5,91.5 108,92 R26.2
N$11
  Top 0.152: C19.2 114,74.69 114,77 114.7,77.7 U4.9
N$12
  Top 0.152: C19.1 121.5,72.19 121.5,60.5 120.5,59.5 R12.2 R8.1
N$13
  Top 0.152: R44.1 19.85,95.2 C66.1 R47.2
N$14
  Top 0.152: U3.7 108.95,88.05 108,89 R25.1
N$15
  Top 0.152: R7.2 R10.2 119.4,80.06 | 119.4,80.06 C17.2 | U4.10 117.35,78.35 119.06,80.06 119.4,80.06
N$16
  Top 0.152: U5.6 109.2,66.7 108.5,66 108.5,64.46 C59.2
N$17
  Top 0.152: U4.6 111.3,77.7 111.91,77.09 111.91,74.41 111,73.5 C51.2
N$18
  Top 0.152: R4.1 118,89 117,88 115.94,88 U3.8
N$19
  Top 0.152: C48.1 103.6,80 R29.1 | U4.7 106.65,77.05 R29.1 | R29.1 R32.1
N$20
  Top 0.152: R30.2 R33.2 106.54,82.94 C48.2 108.19,78.35 U4.5
N$21
  Top 0.152: U5.7 110.11,65.11 108.1,63.1 R37.1
N$22
  Top 0.152: U5.5 106.95,67.35 R38.2
N$23
  Top 0.406: C13.- 129,18 IC3.IN 123,18 119.85,14.85 C14.2 117.73,14.85 115,12.12 D7.A 114.12,11.12 111,8 99,8 97,6 92,6 89,9 D6.A
N$24
  Top 0.406: D1.C 110.03,24.88 C2.1 106.5,22.85 104.19,20.54 IC1.IN 101.46,20.54 C1.+ 93.5,27.5 84.88,18.88 D2.C
N$25
  Top 0.152: C66.2 17.05,96.85 R48.2 13.35,96.85 12.63,96.14 IC9.3
N$26
  Top 0.152: U6.36 60.3,55.35 C52.2
N$27
  Top 0.813: B1.- 36.8,9.19 K1.S2
N$28
  Top 0.152: R5.2 118,92 117.5,91.5 117.5,90 116.85,89.35 U3.10
N$29
  Top 0.152: C51.1 103.5,73.5 104.5,72.5 104.5,60.5 105.5,59.5 R36.2 R31.1
N$30
  Top 0.152: C52.1 60.65,57.85 60.75,57.75 62.25,56.25 U6.35
N$31
  Top 0.152: IC9.2 11.37,93.48 R49.2 R51.2
N$32
  Top 0.152: IC9.1 10.1,93.06 R49.1 10.15,92 D9.A
N$33
  Top 0.152: D9.C 5.85,92.2 R50.2 C67.2 R46.2
N$34
  Top 0.152: R46.1 9.35,98.5 11.5,98.5 12.63,99.64 IC9.6
N$35
  Top 0.152: VR1.2 19.15,100.6 IC9.5
N$36
  Top 0.152: R45.2 13.85,103.85 11.37,101.36 IC9.7 11.37,99.36 11.25,99.25 R43.1
N$37
  Top 0.152: R43.2 6.25,99.35 LED1.A
N$38
  Top 0.152: R47.1 19.15,99 23,99 23.36,99.36 IC8.7 IC8.6
N$39
  Top 0.152: IC8.2 IC8.1 20.2,93.5 R44.2
N$40
  Top 0.152: X1.6 104.75,127.75 102,125 102,122.15 99.65,119.8 U7.5
N$41
  Top 0.152: X1.5 99.65,128.15 U7.10
N$42
  Top 0.152: U7.9 100.48,124.06 100.48,124.75 105.73,130 108.5,130 110,128.5 110,127.5 108.5,126 106,126 105,125 R35.1
N$43
  Top 0.152: U7.6 100.3,119.02 102.28,121 106,121 108.6,123.6 R28.1
N$44
  Top 0.152: IC4.6 110.54,102 108,102 106,104 106,106 R40.1 106,108 105,109 103,109 102,110 R42.2
N$45
  Top 0.152: IC4.2 115.59,110.81 R18.1 R21.2
N$46
  Top 0.152: X1.3 123.75,127.75 120,124 120,121.5 117.65,119.15 U8.5
N$47
  Top 0.152: X1.2 117.65,128.15 U8.10
N$48
  Top 0.152: U8.9 118.48,124.06 118.48,124.75 123.73,130 126.5,130 128,128.5 128,127.5 126.5,126 124,126 123,125 R19.1
N$49
  Top 0.152: U8.6 118.3,118.8 120.5,121 124,121 126.6,123.6 R11.1
N$50
  Top 0.406: T1.C 75.05,14.1 D4.A 72.34,16.81 K1.2
N$51
  Top 0.813: K2.P1 59.51,115.49 57,118 57,123.54 J6.2
N$53
  Top 0.813: R1.1 62.5,3.5 58,8 58,14.38 K1.O1
N$54
  Top 0.152: R41.2 68.35,49.35 69.5,50.5 69.5,52.5 67.75,54.25 U6.24 67.75,56.25 71.5,60 71.5,61.5 72.5,62.5 C58.1
N$55
  Top 0.152: U6.19 70.25,57.25 70.5,57.5 R27.1 73.5,57.5 74,58 74,63.15 74.85,64 C49.1
N$56
  Top 0.152: U6.18 70.61,65 C49.2
N$57
  Top 0.406: D11.C 128.85,33 132,33 132.85,33.85 C8.1 | D12.C 136.15,34 C8.1 | U1.3 134.29,35.44 C8.1
N$59
  Top 0.813: R1.2 55.57,8.5 K1.O2
N$61
  Top 0.813: J5.1 75,123.54 75,118 72.49,115.49 K2.P2
N$62
  Top 0.813: R34.2 47.5,119.04 C50.2
N$63
  Top 0.406: T3.E 33.18,53.9 J10.1 33.85,54.33 D10.C
N$64
  Top 0.813: C46.1 46.46,116 R24.1
N$65
  Top 0.152: U6.34 62.75,36.75 58,32 45.8,32 C60.+
N$66
  Top 0.152: U6.29 65.25,54.35 64.25,53.35 64.25,35.25 62.5,33.5 62.5,23.25 61.25,22 57,22 53,26 51,26 50.5,25.5 50.5,23.25 50,22.75 45.05,22.75 C61.+
N$67
  Top 0.813: R22.2 84.54,121.96 C31.2
N$68
  Top 0.813: C26.1 85.54,116 R16.1
N$69
  Top 0.152: U6.8 65.25,65.25 65.5,65.5 65.75,65.25 U6.9
  Top 0.813: 65.5,65.5 65.5,88.5 58.98,95.03 L4.1 58,92.46 C47.2
N$70
  Top 0.152: U6.11 66.75,65.25 66.5,65.5 66.25,65.25 U6.10
  Top 0.813: 74,95 73,95 66.5,88.5 66.5,65.5 | 74,95 L2.1 | C38.2 74,92.46 74,95
N$71
  Top 0.813: C38.1 R20.1
N$72
  Top 0.813: R23.1 C47.1
N$73
  Top 0.152: U6.16 69.25,65.25 69.5,65.5 69.75,65.25 U6.17
  Top 0.813: 69.5,65.5 69.5,66 70.5,67 72,67 91.6,86.6 R20.2 88,93.6 L1.1
N$74
  Top 0.152: U6.2 62.25,65.25 62.5,65.5 62.75,65.25 U6.3
  Top 0.813: 62.5,65.5 62.5,66 61.5,67 60,67 40.4,86.6 R23.2 44,93.6 L3.1
N$75
  Top 0.406: 58.3,137.3 59.79,135.81 K2.2 | 58.3,137.3 T2.C | D8.A 58.15,137.15 58.3,137.3
N$76
  Top 0.152: IC6.13 10,118.43 10,120.5 12.5,123 14.82,123 J7.3
N$77
  Top 0.152: IC6.20 9.4,110.97 C28.1
N$78
  Top 0.152: IC6.12 10.5,119.07 10.5,120 13,122.5 16.86,122.5 J7.4
N$81
  Top 0.152: JP6.1 82.94,25 C22.1
N$82  (via drill 0.35)
  Top 0.152: v16.5,113 16.57,113 IC6.29 17.75,111.82 17.75,111.05 C23.2 R13.1
  Bottom 0.152: v16.5,113 21,117.5 21,132 20.27,132.73 X3.5
N$84
  Top 0.152: JP6.5 84.52,21.5 53.5,21.5 51.46,23.54 C37.1
N$85  (via drill 0.35)
  Top 0.152: IC6.30 18.38,112.32 v18.38,111.75
  Bottom 0.152: v18.38,111.75 18.38,112.88 21.23,115.73 35.77,115.73 36.25,115.25 36.25,109.75 35.69,109.19 JP4.4
N$86  (via drill 0.35)
  Top 0.152: IC6.31 19,112.83 v19,112.5
  Bottom 0.152: v19,112.5 21.75,115.25 35.5,115.25 35.75,115 35.75,112 35.48,111.73 JP4.3
OUT_L_DAMPED
  Top 0.152: C59.1 100.5,61.54 100.5,51 101,50.5 104.5,50.5 R36.1 106.5,51.5 107,51 107,48.46 IC5.6
OUT_R_DAMPED
  Top 0.152: C25.1 126,61.04 126,51 125,50 121.5,50 120.5,51 R12.1 119.5,51.5 119,51 119,50 121,48 121,45 119.73,43.73 IC5.2
PE  (via drill 0.35)
  Top 0.152: U6.1 61.75,65 61.5,65.25
  Top 0.813: 61.5,65.25 v61.5,63.25 v60.75,62.5
  Bottom 0.813: v61.5,63.25 v60.75,62.5 56.25,58 34.2,58 31.2,55 J4.P$2
  pour Bottom (isolate 0.254): 8,139 8,9 9,8 81,8 82,7 82,3.5 83.5,2 130.5,2 132,3.5 132,139 133,140 140,140 140,0 0,0 0,140 7,140
  pour Top (isolate 0.254): 81,8 9,8 8,9 8,139 7,140 0,140 0,0 140,0 140,140 133,140 132,139 132,3.5 130.5,2 83.5,2 82,3.5 82,7
POWER_LED  (via drill 0.35)
  Top 0.152: v13,107.5 18.75,101.75 20,101.75 20.75,101 v20.75,99.5 | IC6.14 11.25,116.05 v11.25,116
  Bottom 0.152: v20.75,99.5 21,99.25 21,93 21.5,92.5 31.97,92.5 X4.2 | v11.25,116 13,114.25 v13,107.5
PREAMP_OUT_L
  Top 0.152: JP6.6 98.71,32.46 99.7,33.45 U2.9
PREAMP_OUT_R
  Top 0.152: U2.6 99.7,45.7 98,44 98,37.56 JP6.2
PWR_BTN  (via drill 0.35)
  Top 0.152: IC6.1 23.25,111.82 23.25,111 v23.22,111
  Bottom 0.152: X2.2 33.27,98.45 23.22,108.5 v23.22,111
R_OUT+
  Top 0.813: C35.1 88.46,105.44 L1.2 82.03,104.97 76.59,110.41 K2.S2 | C30.1 92.5,117.96 R16.2
  Bottom 0.813: C35.1 93.54,117.08 C30.1
R_OUT-
  Top 0.813: C36.2 87.54,114 91.54,114 C35.2 93.54,102.54 91,100 78.97,100 L2.2 | R22.1 87.5,124.5 85.54,126.46 J5.2
  Bottom 0.813: C36.2 86.5,112.96 86.5,128.04 J5.2
SCL  (via drill 0.35)
  Top 0.152: IC6.28 17.04,111.4 17.04,109.78 16.9,109.64 R52.1 17.3,109 18.5,109 20,107.5 20.75,107.5 25.19,111.94 25.19,116.7 v27.99,119.5 v28,119.5 28,125 29,126 31,126 31.81,125.19 J8.4 | U8.2 115.7,118.8 v115,119.5 | U7.2 97.7,119.3 v97.5,119.5 | v108.93,92 108.93,91.83 109.47,91.3 U3.2 | U4.2 108.7,80.3 v108.5,80.5 | U5.2 109.13,69.3 108.5,69.93 v108.5,70 | U2.2 102.3,49.38 v102.18,49.5 | v97,92.5 v97,90.5 | v97,82 v97,80 | v97,70 v97,68
  Bottom 0.152: v108.93,92 97.5,92 v97,92.5 97,119 v97.5,119.5 v115,119.5 116,119.5 116.5,120 116.5,121 111,126.5 111,129.25 106,134.25 43.25,134.25 28.5,119.5 v27.99,119.5 | v97,90.5 97,83 | 97,83 98,82 107,82 v108.5,80.5 | 97,83 v97,82 | v97,80 97,71 | 97,71 98,70 v108.5,70 | 97,71 v97,70 | v97,68 97,51 98,50 101.68,50 v102.18,49.5
SDA  (via drill 0.35)
  Top 0.152: IC6.27 16.5,110.8 16.5,109.5 15.4,108.4 R2.1 16.6,107.1 18,108.5 18.5,108.5 20,107 21,107 25.73,111.73 25.73,115.98 v29.25,119.5 29.27,119.52 J8.3 | v116,120.5 116.35,120.15 U8.3 | v98,120 98.35,119.65 U7.3 | U3.3 109.17,90.65 v108.97,90.85 | U5.3 108.85,68.65 v108.5,69 | U2.3 101.65,49.35 v101.5,49.5 | U4.3 108.65,79.65 v108.5,79.5
  Bottom 0.152: v108.97,90.85 108.32,91.5 97,91.5 96.5,92 | 96.5,92 96.5,119.5 97,120 v98,120 115.5,120 v116,120.5 110.5,126 110.5,128.75 105.5,133.75 43.25,133.75 29.25,119.75 v29.25,119.5 | 96.5,92 96.5,81.5 | v108.5,79.5 107,81 97,81 96.5,81.5 | 96.5,81.5 96.5,69.5 | 96.5,69.5 97,69 v108.5,69 | 96.5,69.5 96.5,50.5 97.5,49.5 v101.5,49.5
SPK_PROTECT
  Top 0.152: IC6.11 11.25,119.45 11.25,119.75 13.5,122 18.5,122 27.5,131 29,131 31.5,133.5 38.58,133.5 40.17,131.9 41.51,131.9 42,132.39 42,137 43.45,138.45 T2.B
T_SENSE  (via drill 0.35)
  Top 0.152: v80,65 80,63.2 U9.2 | IC6.24 11,108.04 v11,108
  Bottom 0.152: v11,108 11,106.5 12.5,105 12.5,84.75 15.5,81.75 71,81.75 74,78.75 74,68 73,67 73,66 74,65 v80,65
V+
  Top 0.406: D2.A 81.12,16 83,14.12 83,7 77,1 21.54,1 J1.P$2
  Top 0.813: J1.P$2 16.01,6.53 16.01,6.55 | B1.AC1 18.01,8.55 16.01,6.55 | J1.P$1 16.01,6.55
V-
  Top 0.406: D6.C 81.12,7.12 76,2 48,2 46,4 J3.P$2
  Bottom 0.813: J3.P$2 J3.P$1 25.46,12.96 B1.AC2
VDD  (via drill 0.35)
  Top 0.305: C62.2 68.35,52.65 67,54 66.75,54.25 U6.26 66.75,56.75 v67,57
  Top 0.406: R27.2 75.5,57.5 v76,57
  Bottom 0.406: v76,57 v67,57
VPP  (via drill 0.35)
  Top 0.406: D12.A v136.25,38.25 | v22,139 18.19,139 X3.2
  Bottom 0.406: v136.25,38.25 131,38.25 130,39.25 130,101 129,102 129,128.5 122.5,135 74,135 70,139 v22,139

## Text on the board
tPlace: ICSP | SPEAKER / LEFT | SPEAKER / RIGHT | +5V | ENCODER | DISPLAY | CHANNEL B | CHANNEL A | MCP / 4641 | MCP / 4641 | USB / POWER | L | G | R | 74HCT04 | MIXER OUT | ATMEGA328 | EQ IN | SERIAL | GND / 3V3 / RXD / TXD | OPA134PA | DETECT / SENSITIVITY | STANDBY / BUTTON | LM358 | LM358 | L | R | DC / COUPLE | POWER / LED | MCP / 4641 | MCP / 4641 | 10.000µF | MCP / 4641 | TDA7498 | FAN | PE | MCP / 4641 | OPA134PA | AMP IN | PREAMP OUT | 1117 / 3.3 | R | G | 10.000µF | L | 0V | 3V3 | 0V | 0V | +12 | -12 | +12V | -12V | 470 | +12VAC | -12VAC | 0V
bPlace: AVR ICSP | CHANNEL B | CHANNEL A | Speaker Left | Speaker Right | GND | BTN | E A | E B | GND | +5V | SDA | SCL | ENCODER | DISPLAY | GND | L | GND | R | Mixer Out | +3V3 | EQ In | TXD | RXD | DC | L | R | Couple | PE | nupo-artworks.de | Class D Amplifier / 100W + 100 W | R | STAR / GROUND | GND | GND | +3V3 | L | Amp In | Preamp Out | GND | GND | +12V | -12V | DC+ | ~V+ | ~V- | DC- | PE - GND / REF | V+ | V- | 0V
tNames: AUDIO DETECT